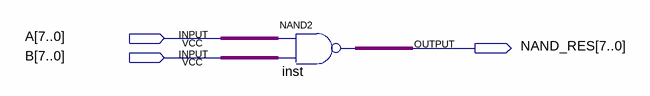
[diagram p0: schematic sheet]
// Quartus schematic NAND_ALU.bdf as structural Verilog: 1 symbols, 3 pins
module NAND_ALU (
  input  [7:0] A,
  input  [7:0] B,
  output [7:0] NAND_RES
);

  assign NAND_RES = ~(A & B);  // NAND2 inst, 8 bits wide
endmodule
